# Altium schematic sheet MCU.SchDoc: MCU
size A3; Author: NGUYEN QUANG MINH; SheetNumber: 4; SheetTotal: 5; ProjectTitle: Arduino_DIY_V1.0
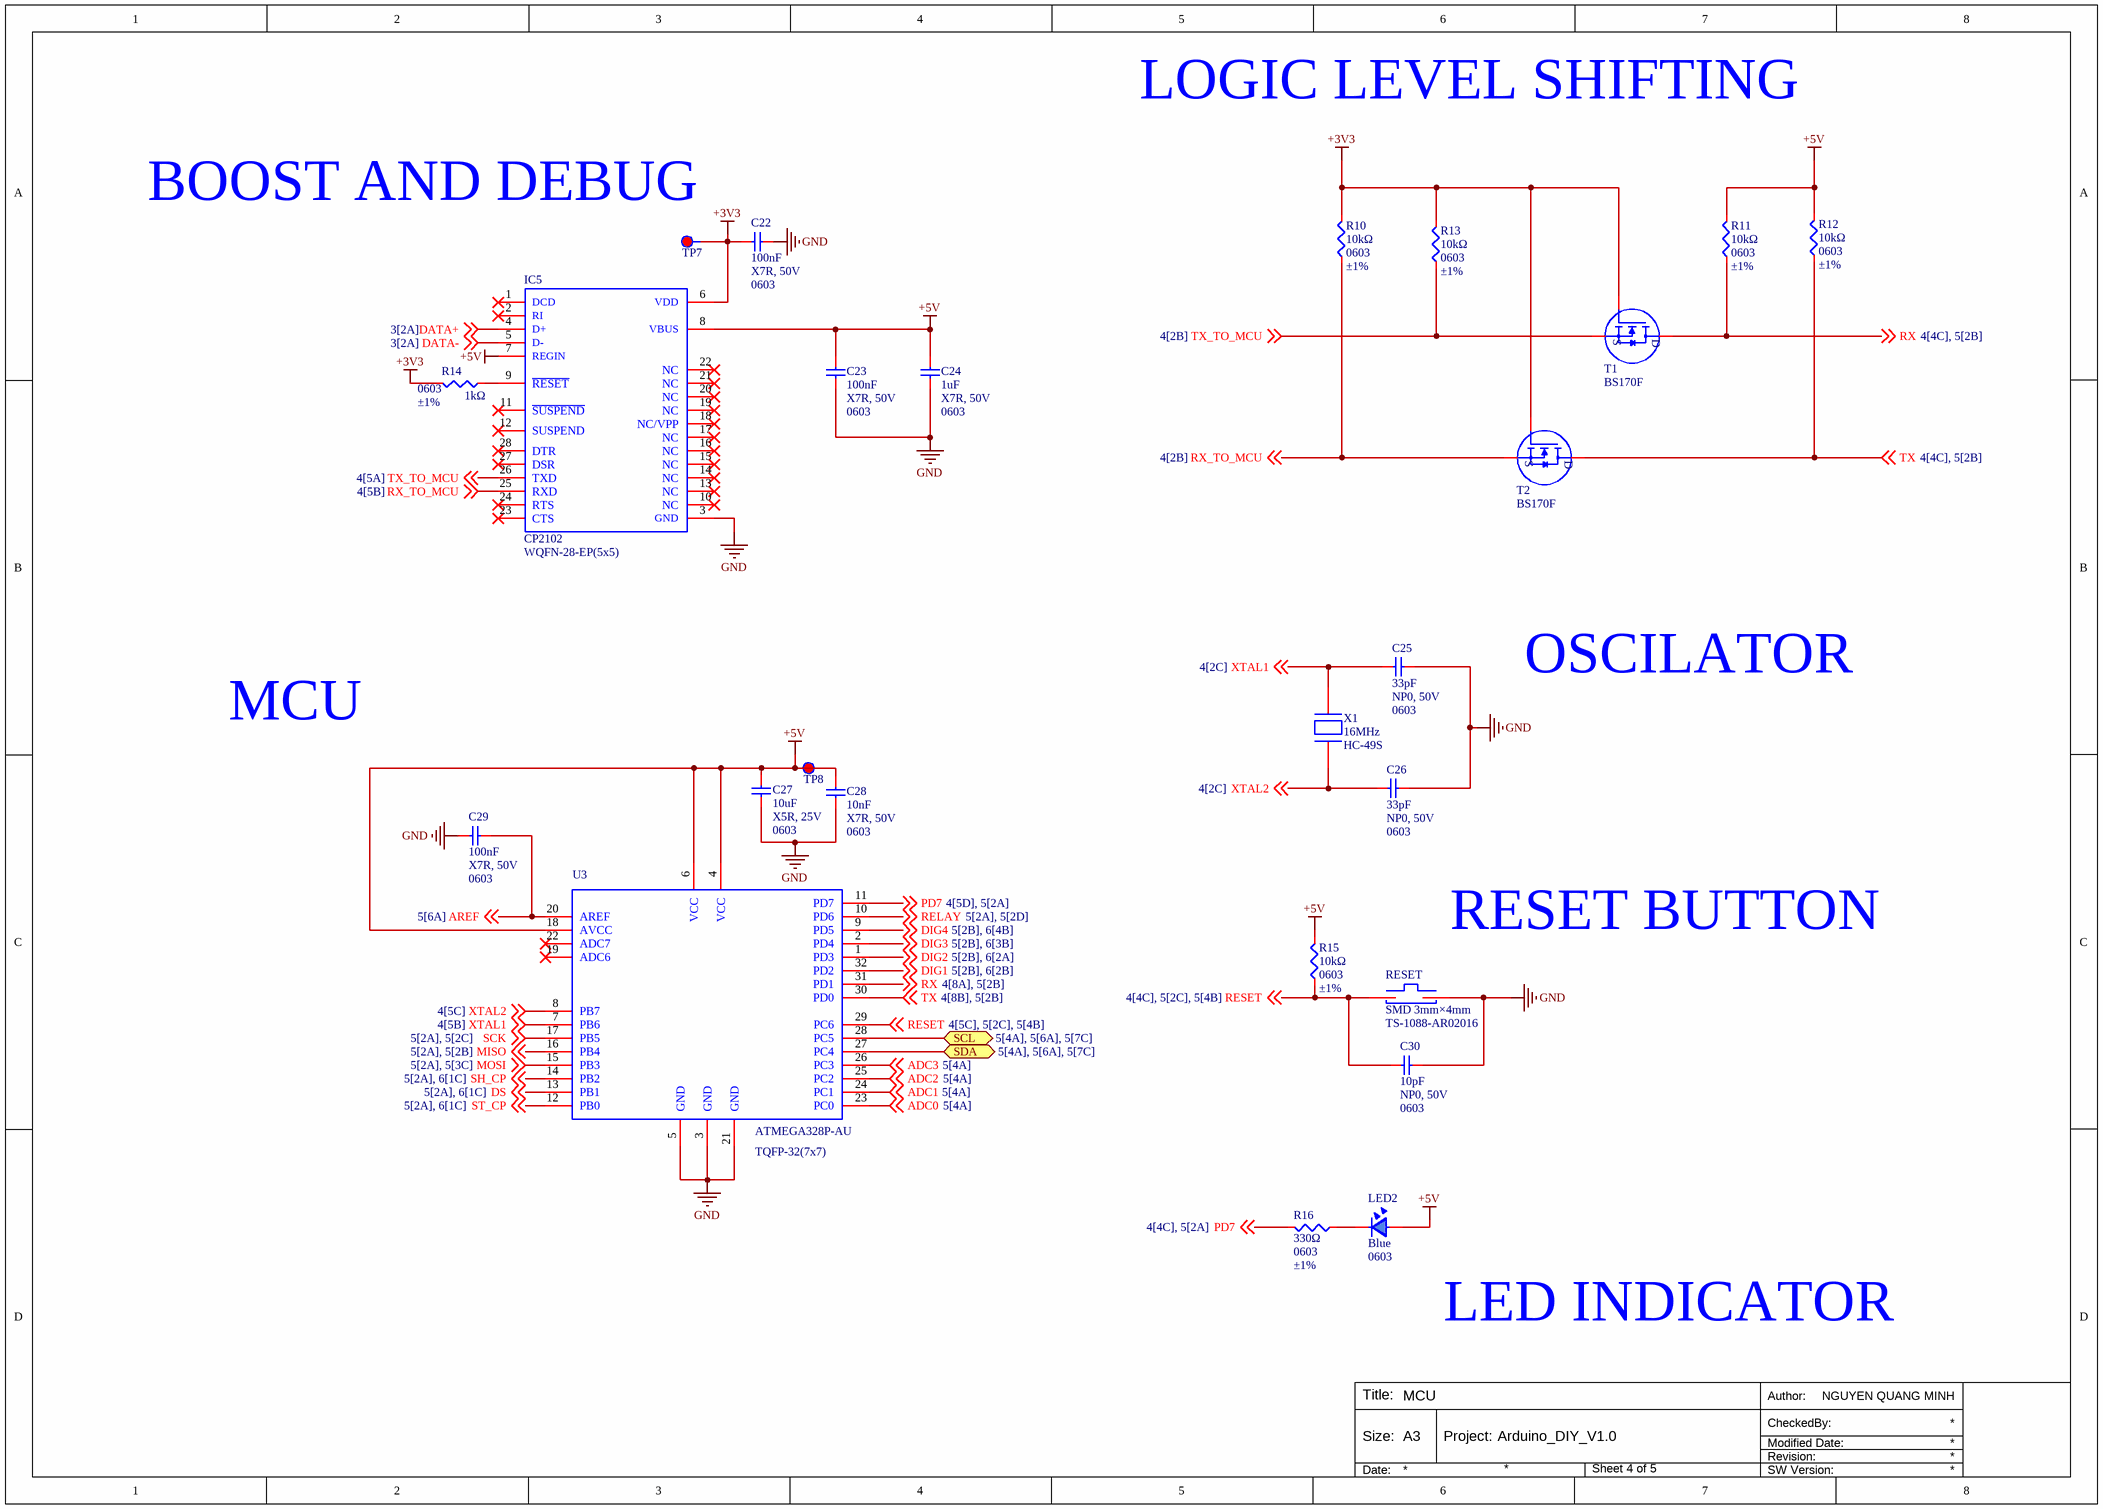
[diagram p0: MCU.SchDoc]

## Parts
C22  100nF  Temperature Coefficient: X7R, 50V  Package: 0603  [C0603]
C23  100nF  Temperature Coefficient: X7R, 50V  Package: 0603  [C0603]
C24  1uF  Temperature Coefficient: X7R, 50V  Package: 0603  [C0603]
C25  33pF  Temperature Coefficient: NP0, 50V  Package: 0603  [C0603]
C26  33pF  Temperature Coefficient: NP0, 50V  Package: 0603  [C0603]
C27  10uF  Temperature Coefficient: X5R, 25V  Package: 0603  [C0603]
C28  10nF  Temperature Coefficient: X7R, 50V  Package: 0603  [C0603]
C29  100nF  Temperature Coefficient: X7R, 50V  Package: 0603  [C0603]
C30  10pF  Temperature Coefficient: NP0, 50V  Package: 0603  [C0603]
IC5  CP2102  [WQFN-28-EP(5x5)]
LED2  Blue  Package: 0603  [LED0603_BLUE]
R10  10kΩ  Package: 0603  Tolerance: ±1%  [R0603]
R11  10kΩ  Package: 0603  Tolerance: ±1%  [R0603]
R12  10kΩ  Package: 0603  Tolerance: ±1%  [R0603]
R13  10kΩ  Package: 0603  Tolerance: ±1%  [R0603]
R14  1kΩ  Package: 0603  Tolerance: ±1%  [R0603]
R15  10kΩ  Package: 0603  Tolerance: ±1%  [R0603]
R16  330Ω  Package: 0603  Tolerance: ±1%  [R0603]
RESET  SMD 3mm×4mm  Mfr. Part: TS-1088-AR02016  [ROUND_BUTTON_SMD 3*4mm]
T1  BS170F  [SOT-23]
T2  BS170F  [SOT-23]
TP7  Test Point  [TEST_POINT]  (value not drawn)  (no BOM)
TP8  Test Point  [TEST_POINT]  (value not drawn)  (no BOM)
U3  ATMEGA328P-AU  Package: TQFP-32(7x7)  [TQFP-32 (7x7)]
X1  16MHz  [HC-49S]

## Ports
SCL (bidir, see 5[4A], 5[6A], 5[7C]), SDA (bidir, see 5[4A], 5[6A], 5[7C])

## Nets
+3V3: C22.2 IC5.6(VDD) R10.2 R13.2 R14.2 T1.1(G) T2.1(G) TP7.1
+5V: C23.2 C24.2 C27.2 C28.2 IC5.7(REGIN) IC5.8(VBUS) LED2.1 R11.2 R12.2 R15.2 TP8.1 U3.4(VCC) U3.6(VCC) U3.18(AVCC)
GND: C22.1 C23.1 C24.1 C25.2 C26.2 C27.1 C28.1 C29.1 C30.2 IC5.3(GND) RESET.2 U3.3(GND) U3.5(GND) U3.21(GND)
ADC0: U3.23(PC0) ; off-sheet ADC0
ADC1: U3.24(PC1) ; off-sheet ADC1
ADC2: U3.25(PC2) ; off-sheet ADC2
ADC3: U3.26(PC3) ; off-sheet ADC3
AREF: C29.2 U3.20(AREF) ; off-sheet AREF
DATA+: IC5.4(D+) ; off-sheet DATA+
DATA-: IC5.5(D-) ; off-sheet DATA-
DIG1: U3.32(PD2) ; off-sheet DIG1
DIG2: U3.1(PD3) ; off-sheet DIG2
DIG3: U3.2(PD4) ; off-sheet DIG3
DIG4: U3.9(PD5) ; off-sheet DIG4
DS: U3.13(PB1) ; off-sheet DS
MISO: U3.16(PB4) ; off-sheet MISO
MOSI: U3.15(PB3) ; off-sheet MOSI
PD7: R16.1 U3.11(PD7) ; off-sheet PD7
RELAY: U3.10(PD6) ; off-sheet RELAY
RESET: C30.1 R15.1 RESET.1 U3.29(PC6) ; off-sheet RESET
RX: R11.1 T1.3(D) U3.31(PD1) ; off-sheet RX
RX_TO_MCU: IC5.25(RXD) R10.1 T2.2(S) ; off-sheet RX_TO_MCU
SCK: U3.17(PB5) ; off-sheet SCK
SCL: U3.28(PC5) ; port SCL
SDA: U3.27(PC4) ; port SDA
SH_CP: U3.14(PB2) ; off-sheet SH_CP
ST_CP: U3.12(PB0) ; off-sheet ST_CP
TX: R12.1 T2.3(D) U3.30(PD0) ; off-sheet TX
TX_TO_MCU: IC5.26(TXD) R13.1 T1.2(S) ; off-sheet TX_TO_MCU
XTAL1: C25.1 U3.7(PB6) X1.2 ; off-sheet XTAL1
XTAL2: C26.1 U3.8(PB7) X1.1 ; off-sheet XTAL2
NetIC5_9: IC5.9(~{RESET}) R14.1
NetLED2_2: LED2.2 R16.2

Not connected (* = marked no-connect by the designer): IC5 1(DCD)* 2(RI)* 10(NC)* 11(~{SUSPEND})* 12(SUSPEND)* 13(NC)* 14(NC)* 15(NC)* 16(NC)* 17(NC)* 18(NC/VPP)* 19(NC)* 20(NC)* 21(NC)* 22(NC)* 23(CTS)* 24(RTS)* 27(DSR)* 28(DTR)*; U3 19(ADC6)* 22(ADC7)*

## Notes on the sheet
- LOGIC LEVEL SHIFTING
- BOOST AND DEBUG
- OSCILATOR
- MCU
- RESET BUTTON
- LED INDICATOR
- Author:
- Title:
- Size:
- A3
- Project:
- Revision:
- Modified Date:
- CheckedBy:
- Date:
- SW Version:

## Library data of the parts
C22 C23 C29 = C0603_MLCC_100nF_X7R_50V: 50V 100nF X7R ±10% 0603 Multilayer Ceramic Capacitors MLCC - SMD/SMT ROHS; Manufacturer: YAGEO; Mfr. Part: CC0603KRX7R9BB104; LCSC Part: C14663; Capacitance: 100nF; Link: https://www.lcsc.com/product-detail/C14663.html; Tolerance: ±10%; Voltage Rating: 50V
C24 = C0603_MLCC_1uF_X7R_50V: 50V 1uF X7R ±10% 0603 Multilayer Ceramic Capacitors MLCC - SMD/SMT ROHS; Manufacturer: YAGEO; Mfr. Part: CC0603KRX7R9BB105; LCSC Part: C559769; Capacitance: 1uF; Link: https://www.lcsc.com/product-detail/C559769.html; Tolerance: ±10%; Voltage Rating: 50V
C25 C26 = C0603_MLCC_33pF_NP0_50V: 50V 33pF NP0 ±5% 0603 Multilayer Ceramic Capacitors MLCC - SMD/SMT ROHS; Manufacturer: YAGEO; Mfr. Part: CC0603JRNPO9BN330; LCSC Part: C107047; Capacitance: 33pF; Link: https://www.lcsc.com/product-detail/C107047.html; Tolerance: ±5%; Voltage Rating: 50V
C27 = C0603_MLCC_10uF_X5R_25V: 25V 10uF X5R ±20% 0603 Multilayer Ceramic Capacitors MLCC - SMD/SMT ROHS; Manufacturer: YAGEO; Mfr. Part: CC0603MRX5R8BB106; LCSC Part: C596327; Capacitance: 10uF; Link: https://www.lcsc.com/product-detail/C596327.html; Tolerance: ±20%; Voltage Rating: 25V
C28 = C0603_MLCC_10nF_X7R_50V: 50V 10nF X7R ±10% 0603 Multilayer Ceramic Capacitors MLCC - SMD/SMT ROHS; Manufacturer: YAGEO; Mfr. Part: CC0603KRX7R9BB103; LCSC Part: C100042; Capacitance: 10nF; Link: https://www.lcsc.com/product-detail/C100042.html; Tolerance: ±10%; Voltage Rating: 50V
C30 = C0603_MLCC_10pF_NP0_50V: 50V 10pF NP0 ±5% 0603 Multilayer Ceramic Capacitors MLCC - SMD/SMT ROHS; Manufacturer: YAGEO; Mfr. Part: CC0603JRNPO9BN100; LCSC Part: C106245; Capacitance: 10pF; Link: https://www.lcsc.com/product-detail/C106245.html; Tolerance: ±5%; Voltage Rating: 50V
IC5 = CP2102: 12Mbps Transceiver WQFN-28-EP(5x5) USB Converters ROHS; Manufacturer: SILICON LABS; Mfr. Part: CP2102-GMR; Key Attributes: Single-Chip USB to UART Bridge; Voltage - Supply: 3V~3.6V; Link: https://www.lcsc.com/product-detail/C6568.html?s_z=n_CP2102-GMR; Data Rate: 12Mbps; Applications Function: Transceiver; LCSC Part: C6568; Package: WQFN-28-EP(5x5)
LED2 = LED0603_Blue: 2mA 24mcd Water Clear -40℃~+85℃ 470nm Blue 130° 120mW 2.65V 0603 LED Indication - Discrete ROHS; Manufacturer: Kingbright; Mfr. Part: APT1608LVBC/D; Key Attributes: 1.6 x 0.8 mm SMD Chip LED Lamp; LCSC Part: C5200747; Illumination Color: Blue; Power(Watts): 120mW; Voltage - Forward(Vf): 2.65V; Forward Current: 2mA; Operating Temperature: -40℃~+85℃; Link: https://www.lcsc.com/product-detail/C5200747.html
R10-R13 R15 = R0603_10kΩ_±1%: 100mW Thick Film Resistor 75V ±100ppm/℃ ±1% 10kΩ 0603 Chip Resistor - Surface Mount ROHS; Manufacturer: YAGEO; Mfr. Part: RC0603FR-0710KL; LCSC Part: C98220; Resistance: 10kΩ; Operating Temperature: -55℃~+155℃; Link: https://www.lcsc.com/product-detail/C98220.html
R14 = R0603_1kΩ_±1%: 100mW Thick Film Resistor 75V ±100ppm/℃ ±1% 1kΩ 0603 Chip Resistor - Surface Mount ROHS; Manufacturer: YAGEO; Mfr. Part: RC0603FR-071KL; LCSC Part: C22548; Resistance: 1kΩ; Operating Temperature: -55℃~+155℃; Link: https://www.lcsc.com/product-detail/C22548.html
R16 = R0603_330Ω_±1%: 100mW Thick Film Resistor 75V ±100ppm/℃ ±1% 330Ω 0603 Chip Resistor - Surface Mount ROHS; Manufacturer: YAGEO; Mfr. Part: RC0603FR-07330RL; LCSC Part: C105881; Resistance: 330Ω; Operating Temperature: -55℃~+155℃; Link: https://www.lcsc.com/product-detail/C105881.html
RESET = SW_BUTTON_SMD_3mm×4mm: Without Bracket 50mA 4mm 100,000 Cycles 12V 1.6N 3mm 2mm Round Button Surface Mount,Vertical SPST SMD Tactile Switches ROHS; Manufacturer: XUNPU; LCSC Part: C720477; Package: SMD; Length: 4mm; Width: 3mm; Voltage Rating: 12V; Operating Temperature: -30℃~+80℃; Link: https://www.lcsc.com/product-detail/C720477.html?s_z=n_Button
T1 T2 = BS170F: 90V 150uA 5Ω@10V 330mW 3V@1mA 1 N-Channel SOT-23 MOSFETs ROHS; Manufacturer: DIODES; Package: SOT-23; LCSC Part: C151050; Category: Transistors/Thyristors/MOSFETs; Number: BS170F; Gate Threshold Voltage (Vgs(th)): 3V@1mA; Link: https://www.lcsc.com/product-detail/C151050.html?s_z=n_BS170
TP7 TP8 = TEST_POINT
U3 = ATMEGA328P-AU: AVR 20MHz TQFP-32(7x7) Microcontrollers (MCU/MPU/SOC) ROHS; Manufacturer: MICROCHIP; Key Attributes: 8-bit Microcontroller with In-System Programmable Flash; ADC (Bit): 10bit; Number of I/O: 23; Program Memory Type: FLASH; EEPROM: 1KB; Program Storage Size: 32KB; Voltage - Supply: 1.8V~5.5V; Mfr. Part: ATMEGA328P-AU; LCSC Part: C14877; CPU Core: AVR; CPU Maximum Speed: 20MHz; Link: https://www.lcsc.com/product-detail/C14877.html
X1 = Crystal_16Mhz_HC49S: 16MHz Through Hole Crystal Oscillator 20pF ±20ppm ±30ppm HC-49S Crystals ROHS; Manufacturer: YXC Crystal Oscillators; Mfr. Part: X49SD16MSD2SC; LCSC Part: C16212; Frequency: 16MHz; Type: Through Hole Crystal Oscillator; Load Capacitance: 20pF; Frequency Stability: ±30ppm; Operating Temperature: -20℃~+70℃; Link: https://www.lcsc.com/product-detail/C16212.html; Package: HC-49S